# Altium schematic sheet 04_GPIOs.SchDoc
size A4; SheetNumber: 5; SheetTotal: 7
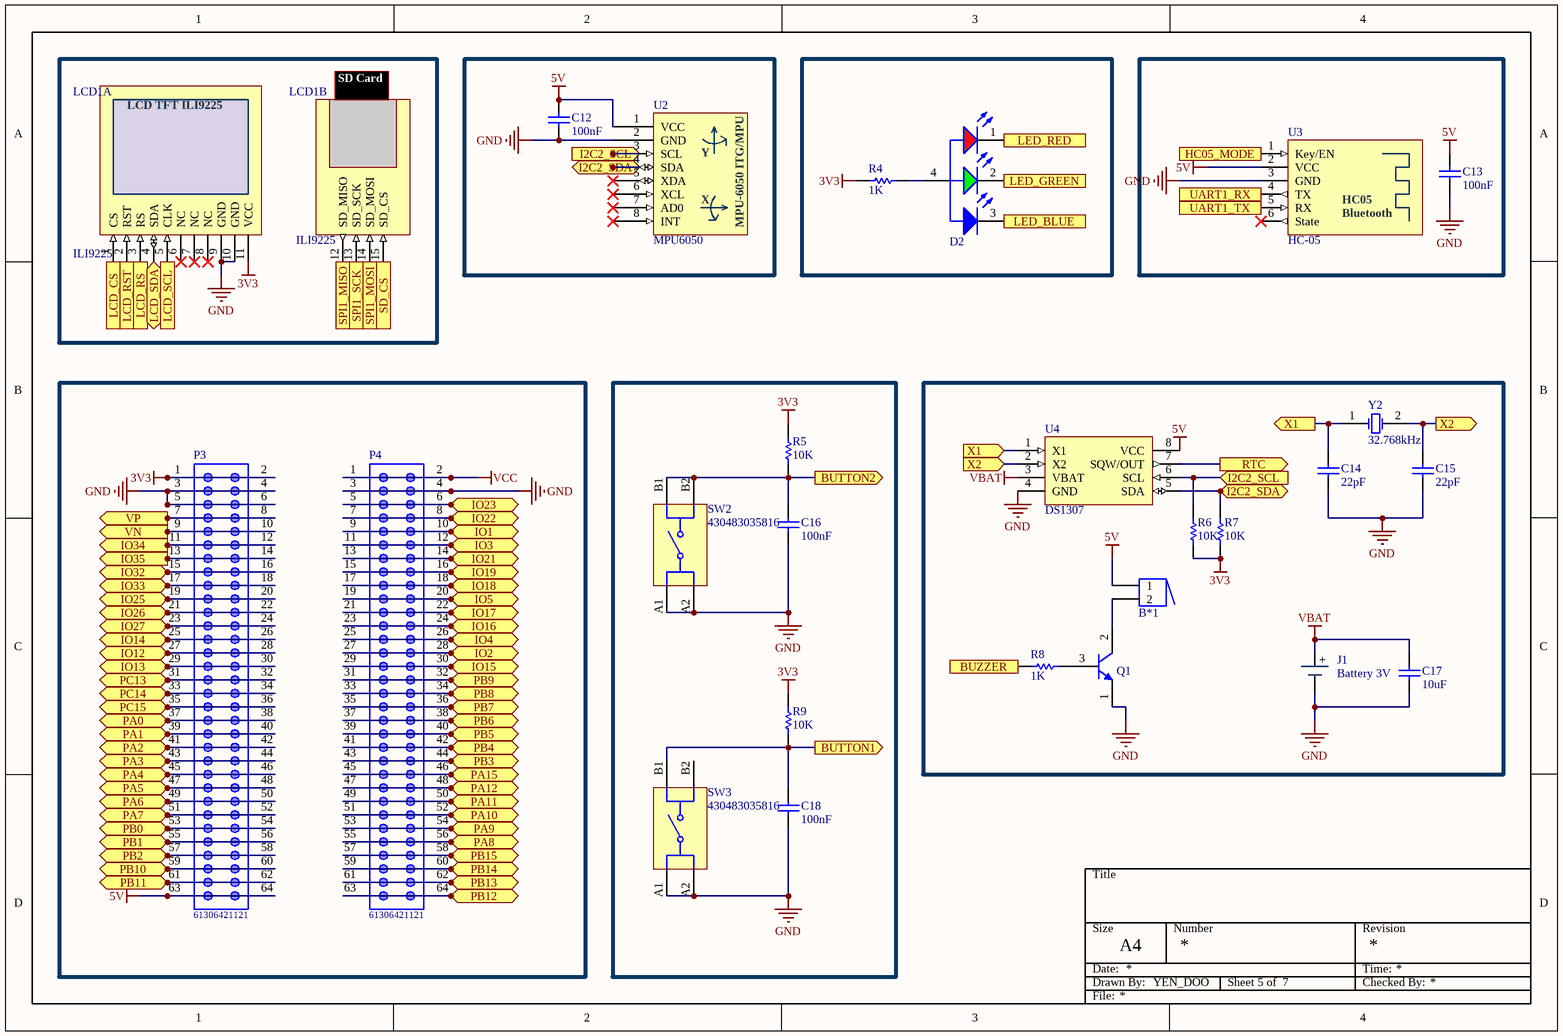
[diagram p0: 04_GPIOs.SchDoc]

## Parts
B*1  Buzzer  [BUZZER]  (value not drawn)
C12  value 100nF  [CAP-SM-0805]  (hidden comment: Cap Non-Pol SMD)
C13  value 100nF  [CAP-SM-0805]  (hidden comment: Cap Non-Pol SMD)
C14  value 22pF  [CAP-SM-0805]  (hidden comment: Cap Non-Pol SMD)
C15  value 22pF  [CAP-SM-0805]  (hidden comment: Cap Non-Pol SMD)
C16  value 100nF  [CAP-SM-0805]  (hidden comment: Cap Non-Pol SMD)
C17  value 10uF  [CAP-SM-0805]  (hidden comment: Cap Non-Pol SMD)
C18  value 100nF  [CAP-SM-0805]  (hidden comment: Cap Non-Pol SMD)
D2  Red & Green & Blue, 120°  [WL-SFCD_0805]  (value not drawn)
J1  Battery 3V  [SocketPin3V]
LCD1  ILI9225  [LCD TFT ILI9225]  (parts A,B of 2)
P3  61306421121  [61306421121]
P4  61306421121  [61306421121]
Q1  C1815  [SOT23B]  (value not drawn)
R4  value 1K  [RES-SM-0805]  (hidden comment: RESISTOR SMD)
R5  value 10K  [RES-SM-0805]  (hidden comment: RESISTOR SMD)
R6  value 10K  [RES-SM-0805]  (hidden comment: RESISTOR SMD)
R7  value 10K  [RES-SM-0805]  (hidden comment: RESISTOR SMD)
R8  value 1K  [RES-SM-0805]  (hidden comment: RESISTOR SMD)
R9  value 10K  [RES-SM-0805]  (hidden comment: RESISTOR SMD)
SW2  430483035816  [WS-TASV_L6W6H3.5_4304x30358x6]
SW3  430483035816  [WS-TASV_L6W6H3.5_4304x30358x6]
U2  MPU6050  [MPU-6050]
U3  HC-05  [HC-05]
U4  DS1307  [SOIC-4]
Y2  32.768kHz  [WE-XTAL_WATCH_830002997B]

## Ports
BUTTON1 (out), BUTTON2 (out), BUZZER (in), HC05_MODE (in), I2C2_SCL (in), I2C2_SDA (bidir), IO1 (bidir), IO2 (bidir), IO3 (bidir), IO4 (bidir), IO5 (bidir), IO12 (bidir), IO13 (bidir), IO14 (bidir), IO15 (bidir), IO16 (bidir), IO17 (bidir), IO18 (bidir), IO19 (bidir), IO21 (bidir), IO22 (bidir), IO23 (bidir), IO25 (bidir), IO26 (bidir), IO27 (bidir), IO32 (bidir), IO33 (bidir), IO34 (out), IO35 (out), LCD_CS (in), LCD_RS (in), LCD_RST (in), LCD_SCL (in), LCD_SDA (bidir), LED_BLUE (in), LED_GREEN (in), LED_RED (in), PA0 (bidir), PA1 (bidir), PA2 (bidir), PA3 (bidir), PA4 (bidir), PA5 (bidir), PA6 (bidir), PA7 (bidir), PA8 (bidir), PA9 (bidir), PA10 (bidir), PA11 (bidir), PA12 (bidir), PA15 (bidir), PB0 (bidir), PB1 (bidir), PB2 (bidir), PB3 (bidir), PB4 (bidir), PB5 (bidir), PB6 (bidir), PB7 (bidir), PB8 (bidir), PB9 (bidir), PB10 (bidir), PB11 (bidir), PB12 (bidir), PB13 (bidir), PB14 (bidir), PB15 (bidir), PC13 (bidir), PC14 (bidir), PC15 (bidir), RTC (out), SD_CS (in), SPI1_MISO (out), SPI1_MOSI (in), SPI1_SCK (in), UART1_RX (out), UART1_TX (in), VN (out), VP (out), X1 (in), X1 (out), X2 (in), X2 (out)

## Nets
3V3: LCD1.11(VCC) P3.1 P3.2 R4.2 R5.2 R6.2 R7.2 R9.2
5V: B*1.1 C12.2 C13.2 P3.63 P3.64 U2.1(VCC) U3.2(VCC) U4.8(VCC)
GND: C12.1 C13.1 C14.1 C15.1 C16.1 C17.1 C18.1 J1.2(GND) LCD1.9(GND) LCD1.10(GND) P3.3 P3.4 P3.5 P3.6 P4.3 P4.4 Q1.1(E) SW2.A1 SW2.A2 SW3.A1 SW3.A2 U2.2(GND) U3.3(GND) U4.4(GND)
VBAT: C17.2 J1.1(Vcc) U4.3(VBAT)
VCC: P4.1 P4.2
BUTTON1: C18.2 R9.1 SW3.B1 ; port BUTTON1
BUTTON2: C16.2 R5.1 SW2.B1 SW2.B2 ; port BUTTON2
BUZZER: R8.2 ; port BUZZER
HC05_MODE: U3.1(Key/EN) ; port HC05_MODE
I2C2_SCL: R6.1 U2.3(SCL) U4.6(SCL) ; port I2C2_SCL
I2C2_SDA: R7.1 U2.4(SDA) U4.5(SDA) ; port I2C2_SDA
IO1: P4.9 P4.10 ; port IO1
IO2: P4.27 P4.28 ; port IO2
IO3: P4.11 P4.12 ; port IO3
IO4: P4.25 P4.26 ; port IO4
IO5: P4.19 P4.20 ; port IO5
IO12: P3.27 P3.28 ; port IO12
IO13: P3.29 P3.30 ; port IO13
IO14: P3.25 P3.26 ; port IO14
IO15: P4.29 P4.30 ; port IO15
IO16: P4.23 P4.24 ; port IO16
IO17: P4.21 P4.22 ; port IO17
IO18: P4.17 P4.18 ; port IO18
IO19: P4.15 P4.16 ; port IO19
IO21: P4.13 P4.14 ; port IO21
IO22: P4.7 P4.8 ; port IO22
IO23: P4.5 P4.6 ; port IO23
IO25: P3.19 P3.20 ; port IO25
IO26: P3.21 P3.22 ; port IO26
IO27: P3.23 P3.24 ; port IO27
IO32: P3.15 P3.16 ; port IO32
IO33: P3.17 P3.18 ; port IO33
IO34: P3.11 P3.12 ; port IO34
IO35: P3.13 P3.14 ; port IO35
LCD_CS: LCD1.1(CS) ; port LCD_CS
LCD_RS: LCD1.3(RS) ; port LCD_RS
LCD_RST: LCD1.2(RST) ; port LCD_RST
LCD_SCL: LCD1.5(CLK) ; port LCD_SCL
LCD_SDA: LCD1.4(SDA) ; port LCD_SDA
LED_BLUE: D2.3(K) ; port LED_BLUE
LED_GREEN: D2.2(K) ; port LED_GREEN
LED_RED: D2.1(K) ; port LED_RED
PA0: P3.37 P3.38 ; port PA0
PA1: P3.39 P3.40 ; port PA1
PA2: P3.41 P3.42 ; port PA2
PA3: P3.43 P3.44 ; port PA3
PA4: P3.45 P3.46 ; port PA4
PA5: P3.47 P3.48 ; port PA5
PA6: P3.49 P3.50 ; port PA6
PA7: P3.51 P3.52 ; port PA7
PA8: P4.55 P4.56 ; port PA8
PA9: P4.53 P4.54 ; port PA9
PA10: P4.51 P4.52 ; port PA10
PA11: P4.49 P4.50 ; port PA11
PA12: P4.47 P4.48 ; port PA12
PA15: P4.45 P4.46 ; port PA15
PB0: P3.53 P3.54 ; port PB0
PB1: P3.55 P3.56 ; port PB1
PB2: P3.57 P3.58 ; port PB2
PB3: P4.43 P4.44 ; port PB3
PB4: P4.41 P4.42 ; port PB4
PB5: P4.39 P4.40 ; port PB5
PB6: P4.37 P4.38 ; port PB6
PB7: P4.35 P4.36 ; port PB7
PB8: P4.33 P4.34 ; port PB8
PB9: P4.31 P4.32 ; port PB9
PB10: P3.59 P3.60 ; port PB10
PB11: P3.61 P3.62 ; port PB11
PB12: P4.63 P4.64 ; port PB12
PB13: P4.61 P4.62 ; port PB13
PB14: P4.59 P4.60 ; port PB14
PB15: P4.57 P4.58 ; port PB15
PC13: P3.31 P3.32 ; port PC13
PC14: P3.33 P3.34 ; port PC14
PC15: P3.35 P3.36 ; port PC15
RTC: U4.7(SQW/OUT) ; port RTC
SD_CS: LCD1.15(SD_CS) ; port SD_CS
SPI1_MISO: LCD1.12(SD_MISO) ; port SPI1_MISO
SPI1_MOSI: LCD1.14(SD_MOSI) ; port SPI1_MOSI
SPI1_SCK: LCD1.13(SD_SCK) ; port SPI1_SCK
UART1_RX: U3.4(TX) ; port UART1_RX
UART1_TX: U3.5(RX) ; port UART1_TX
VN: P3.9 P3.10 ; port VN
VP: P3.7 P3.8 ; port VP
X1: C14.2 U4.1(X1) Y2.1(OSC1) ; port X1
X2: C15.2 U4.2(X2) Y2.2(OSC2) ; port X2
NetB*1_2: B*1.2 Q1.2(C)
NetD2_4: D2.4(A) R4.1
NetQ1_3: Q1.3(B) R8.1

Not connected (* = marked no-connect by the designer): LCD1 6(NC)* 7(NC)* 8(NC)*; SW3 B2; U2 5(XDA)* 6(XCL)* 7(AD0)* 8(INT)*; U3 6(State)*

## Notes on the sheet
- Title
- Size
- Date:
- Drawn By:
- A4
- YEN_DOO
- Number
- Revision
- Checked By:
- Time:
- File:
- (in symbol Battery-3V) +
- (in symbol HC-05) HC05; Bluetooth
- (in symbol LCD TFT, part A) LCD TFT ILI9225
- (in symbol LCD TFT, part B) SD Card
- (in symbol MPU6050) Y; X; MPU-6050 ITG/MPU

## Library data of the parts
C12-C18 = Cap Non-Pol SMD: Capacitor
D2 = 150080M153000: WL-SFCD SMT Full-color Chip LED Diffused, size 0805, Red & Green & Blue, 120°; Manufacturer: Wurth Elektronik; Case/Size Code: 0805; Chip Technology: AlInGaP + InGaN; Dominant Wavelength (Blue): 470nm; Dominant Wavelength (Green): 525nm; Dominant Wavelength (Red): 624nm; Forward Voltage (Blue): 3.3V; Forward Voltage (Red): 2V; Luminous Intensity (Blue): 70mcd; Luminous Intensity (Green): 285mcd; Luminous Intensity (Red): 112mcd; Peak Wavelength (Blue): 468nm; Peak Wavelength (Green): 520nm; Peak Wavelength (Red): 632nm; Manufacturer Part Number: 150080M153000; Category: Signal LEDs; Match Code: WL-SFCD; ComponentLink1Description: Website Link; ComponentLink1URL: https://www.we-online.com/redexpert/article/150080M153000?ad; ComponentLink2Description: Datasheet Link; ComponentLink2URL: https://www.we-online.com/redexpert/spec/150080M153000?ad; Mount: Surface Mount; Operating Temperature Max: 85°C; Operating Temperature Min: -40°C; Packaging: Tape and Reel; Length: 2mm; Width: 1.3mm; Height: 0.5mm; Emitting Color: Red & Green & Blue; Forward Voltage (Green): 3.3V; Viewing Angle: 120°
J1 = Battery-3V: Socket CR1220 SMD
LCD1 = LCD TFT: The ILI9225 is a 262,144-color one-chip SoC driver for a-TFT liquid crystal display with resolution of 176RGBx220 dots, comprising a 528-channel source driver, a 220-channel gate driver, 87120 bytes RAM for graphic data of 176RGBx220 dots, and power supply circuit.; Display Color: 16BIT RGB 65K color; Screen Size: 2.2(inch); Resolution: 176*220 (Pixel); Module Interface: 4-wire SPI interface; Backlight: 3 White Led; Active Area: 34.85x43.56 (mm); Module PCB Size: 42.46x67.20 (mm); Operating Voltage: 5V/3.3V; Power Consumption: TBD; Rough Weight(Package containing): 23 (g); SKU: MAR2201; Type: TFT; Driver IC: ILI9225; Operating Temperature: -20℃~60℃; Storage Temperature: -30℃~70℃; ComponentLink1Description: Hshop; ComponentLink1URL: https://hshop.vn/products/man-hinh-lcd-tft-2-inch-ili9225-giao-tiep-spi; ComponentLink2Description: Thegioiic; ComponentLink2URL: https://www.thegioiic.com/lcd-2inch-176x220-tft-ili9225-giao-tiep-spi
P3 P4 = 61306421121: WR-PHD Pin Header, THT, pitch 2.54mm, Dual Row, Vertical, 64p; Manufacturer: Wurth Elektronik; Pin Number: 64; Rated Current: 3A; Working Voltage: 250VAC; Withstanding Voltage: 500VAC; Contact Resistance: 20mOhm; ComponentLink1Description: Manufacturer; ComponentLink1URL: http://www.we-online.de; ComponentLink2Description: Datasheet; ComponentLink2URL: https://www.we-online.com/catalog/datasheet/61306421121.pdf; Manufacturer Part Number: 61306421121; Published Date: May 2020; Pitch: 2.54mm; Operating Temperature: -40 to +105degC; Mounting Technology: THT; Packaging: Bag; Gender: Pin Header; Row Number: Dual; Orientation: Vertical
Q1 = C1815: NPN Bipolar Transistor
R4-R9 = RESISTOR SMD: Resistor
SW2 SW3 = 430483035816: WS-TASV J-Bend SMT Washable Tact Switch, 12VDC, 50mA, 160g, height 3.5mm; Manufacturer: Wurth Elektronik; Rated Voltage: 12V; Washable: Yes; Actuator Color: Black; Electrical Life: 1000000Cycles; ComponentLink1Description: Manufacturer Link; ComponentLink1URL: http://www.we-online.de; ComponentLink2Description: Datasheet; ComponentLink2URL: https://www.we-online.com/catalog/datasheet/430483035816.pdf; Manufacturer Part Number: 430483035816; Contact Material: Stainless Steel; Mounting Technology: SMT; Contact Plating: Silver; Operation Force: 160g; Packaging: Tape and Reel; Terminal Material: Copper Alloy; Rated Current: 50mA; Terminal Plating: Silver; Height: 3.5mm; Length: 6mm; Operating Temperature max.: 85C; Operating Temperature min.: -40C; Width: 6mm
U2 = MPU6050: The MPU-6050™ parts are the world’s first MotionTracking devices designed for the low power, low cost, and high-performance requirements of smartphones, tablets and wearable sensors.; Mfr: DFRobot; Sensing Range: ±2g, 4g, 8g, 16g, ±250°/sec, ±500°/sec, ±1000°/sec, ±2000°/sec; Sensor Type: Accelerometer, Gyroscope, 3 Axis; Interface: I2C; Voltage - Supply: 3V ~ 5V; Category: Development Boards, Kits, Programmers; Utilized IC / Part: MPU-6050; ComponentLink1Description: Hshop; ComponentLink1URL: https://hshop.vn/products/cam-bien-6-dof-bac-tu-do-gy-521-mpu6050
U3 = HC-05: HC-05 Bluetooth module follows the IEEE 802.15.1 standardized protocol, through which one can build a wireless Personal Area Network (PAN). It uses frequency-hopping spread spectrum (FHSS) radio technology to send data over the air.; Bluetooth protocol: Bluetooth Specification v2.0+EDR; Frequency: 2.4GHz ISM band; Modulation: GFSK (Gaussian Frequency Shift Keying); Emission power: ≤4dBm, Class 2; Sensitivity: ≤-84dBm at 0.1% BER; Speed: Asynchronous communication: 2.1Mbps (Max) / 160 kbps, Synchronous communication: 1Mbps/1Mbps; Security: Authentication and encryption; Supply Voltage: +3.3V to 6.0 V; Supply Current: 30mA; Working temperature: -20 ~ +75Centigrade; Dimension: 26.9mm x 13mm x 2.2 mm; ComponentLink1Description: Hshop; ComponentLink1URL: https://hshop.vn/products/mach-thu-phat-bluetooth-hc-05-do-ra-chon-master
U4 = DS1307: Real Time Clock (RTC) IC Clock/Calendar 56B I²C, 2-Wire Serial 8-SDIP (0.300", 7.62mm); Mfr: Analog Devices Inc./Maxim Integrated; Time Format: HH:MM:SS (12/24 hr); Date Format: YY-MM-DD-dd; Voltage - Supply: 4.5V ~ 5.5V; Voltage - Supply, Battery: 2V ~ 3.5V; Current - Timekeeping (Max): 200µA @ 5V; Category: Integrated Circuits (ICs); Type: Clock/Calendar; Features: Leap Year, NVSRAM, Square Wave Output; Memory Size: 56B; Interface: I²C, 2-Wire Serial; Operating Temperature: 0°C ~ 70°C; Base Product Number: DS1307; ComponentLink1Description: Datasheet; ComponentLink1URL: https://www.analog.com/media/en/technical-documentation/data-sheets/ds1307.pdf; ComponentLink2Description: Thegioiic; ComponentLink2URL: https://www.thegioiic.com/ds1307z-ic-rtc-clock-calendar-56b-8-soic
Y2 = 830002997B: WE-XTAL Watch Crystal, THT, WATCH, 32.768kHz, +/-20ppm; Manufacturer: Wurth Elektronik; Load Capacitance: 12.5pF; ComponentLink1Description: Manufacturer; ComponentLink1URL: http://www.we-online.de; ComponentLink2Description: Datasheet; ComponentLink2URL: https://katalog.we-online.com/pbs/datasheet/830002997B.pdf; Operating Temperature: -40 to +85degC; Packaging: Bulk; Manufacturer Part Number: 830002997B; Published Date: July 2020; Size: WATCH; Frequency Stability: -; Frequency: 32.768kHz; Frequency Tolerance: +/-20ppm; Mounting Technology: THT